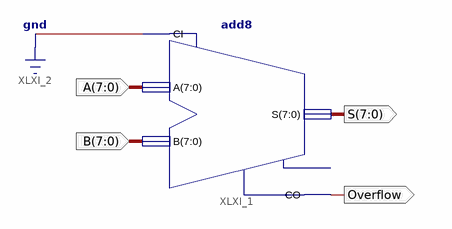
[diagram p0: schematic sheet 1]
// Xilinx ISE schematic Add.sch (spartan6) as structural Verilog: 1 symbols, 4 ports
module Add (
  input  [7:0] A,
  input  [7:0] B,
  output [7:0] S,
  output Overflow
);

  add8 XLXI_1 (.A(A), .B(B), .CI(1'b0), .CO(Overflow), .S(S));  // open: OFL
endmodule
